# EAGLE schematic tes1 (EAGLE 6.6.0)
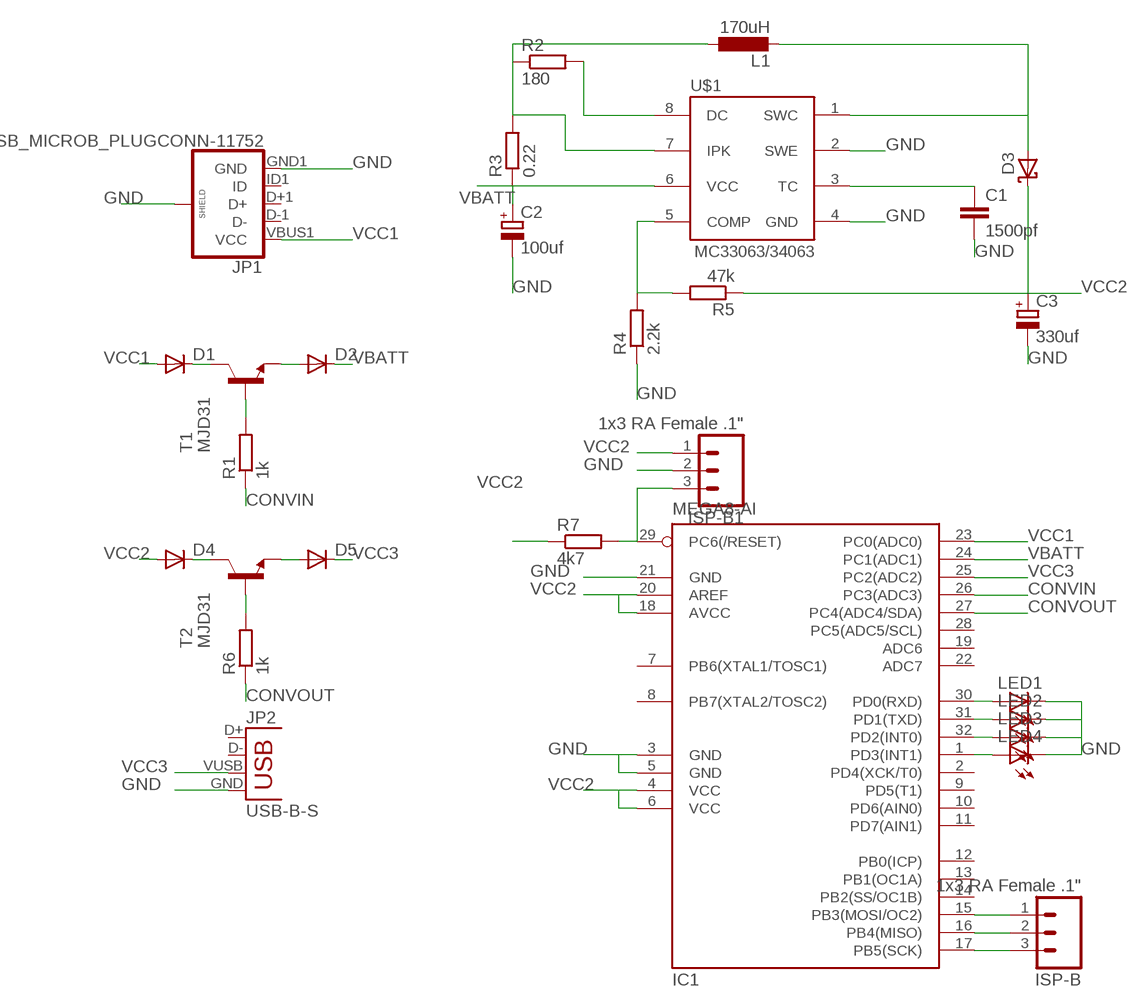
[diagram p0: schematic, sheet 1]

## Parts
C1  1500pf  C-EUC1206  [C1206]
C2  100uf  CPOL-EU153CLV-1014  [153CLV-1014]
C3  330uf  CPOL-EU153CLV-1014  [153CLV-1014]
D1  DIODE-SMC  [SMC]
D2  DIODE-SMC  [SMC]
D3  SCHOTTKY-DIODEF126Z12  [F126Z12]
D4  DIODE-SMC  [SMC]
D5  DIODE-SMC  [SMC]
IC1  MEGA8-AI  [TQFP32-08]
ISP-B  1x3 RA Female .1"  M03SMD_RA_FEMALE  [1X03_SMD_RA_FEMALE]
ISP-B1  1x3 RA Female .1"  M03SMD_RA_FEMALE  [1X03_SMD_RA_FEMALE]
JP1  USB_MICROB_PLUGCONN-11752  [USB-B-MICRO-SMD_V03]
JP2  USB-B-S  [USB-B-SMT]
L1  170uH  L-EUL5650M  [L5650M]
LED1  LEDSML1206  [SML1206]
LED2  LEDSML1206  [SML1206]
LED3  LEDSML1206  [SML1206]
LED4  LEDSML1206  [SML1206]
R1  1k  R-EU_R1206  [R1206]
R2  180  R-EU_R1206  [R1206]
R3  0.22  R-EU_R1206  [R1206]
R4  2.2k  R-EU_R1206  [R1206]
R5  47k  R-EU_R1206  [R1206]
R6  1k  R-EU_R1206  [R1206]
R7  4k7  R-EU_R1206  [R1206]
T1  MJD31  [DPAK]
T2  MJD31  [DPAK]
U$1  MC33063/MC34063D  [SO08]

## Nets
CONVIN: IC1.26(PC3(ADC3)) R1.1
CONVOUT: IC1.27(PC4(ADC4/SDA)) R6.1
GND: C1.2 C2.- C3.- IC1.3(GND) IC1.5(GND) IC1.21(GND) ISP-B1.2 JP1.GND1(GND) JP1.SHIELD1(SHIELD) JP1.SHIELD2(SHIELD) JP1.SHIELD3(SHIELD) JP2.GND LED1.C LED2.C LED3.C LED4.C R4.1 U$1.2(SWE) U$1.4(GND)
N$1: D1.C T1.4(C)
N$2: C1.1 U$1.3(TC)
N$3: D2.A T1.3(E)
N$4: L1.1 R2.1 R3.2 U$1.7(IPK)
N$5: R1.2 T1.1(B)
N$6: R2.2 U$1.8(DC)
N$7: R4.2 R5.2 U$1.5(COMP)
N$8: D4.C T2.4(C)
N$9: D3.A L1.2 U$1.1(SWC)
N$10: D5.A T2.3(E)
N$11: R6.2 T2.1(B)
N$12: IC1.29(PC6(/RESET)) ISP-B1.3 R7.2
N$13: IC1.17(PB5(SCK)) ISP-B.3
N$14: IC1.16(PB4(MISO)) ISP-B.2
N$15: IC1.15(PB3(MOSI/OC2)) ISP-B.1
N$16: IC1.1(PD3(INT1)) LED4.A
N$17: IC1.32(PD2(INT0)) LED3.A
N$18: IC1.31(PD1(TXD)) LED2.A
N$19: IC1.30(PD0(RXD)) LED1.A
VBATT: C2.+ D2.C IC1.24(PC1(ADC1)) R3.1 U$1.6(VCC)
VCC1: D1.A IC1.23(PC0(ADC0)) JP1.VBUS1(VCC)
VCC2: C3.+ D3.C D4.A IC1.4(VCC) IC1.6(VCC) IC1.18(AVCC) IC1.20(AREF) ISP-B1.1 R5.1 R7.1
VCC3: D5.C IC1.25(PC2(ADC2)) JP2.VUSB(VBUS)
Unconnected: IC1.2(PD4(XCK/T0)) IC1.7(PB6(XTAL1/TOSC1)) IC1.8(PB7(XTAL2/TOSC2)) IC1.9(PD5(T1)) IC1.10(PD6(AIN0)) IC1.11(PD7(AIN1)) IC1.12(PB0(ICP)) IC1.13(PB1(OC1A)) IC1.14(PB2(SS/OC1B)) IC1.19(ADC6) IC1.22(ADC7) IC1.28(PC5(ADC5/SCL)) JP1.D+1(D+) JP1.D-1(D-) JP1.ID1(ID) JP2.D+ JP2.D-

## Library data of the parts
C1 = resistor:C-EU: CAPACITOR, European symbol
C2 C3 = resistor:CPOL-EU: POLARIZED CAPACITOR, European symbol
D1 D2 D4 D5 = diode:DIODE-: DIODE
D3 = adafruit:SCHOTTKY-DIODE: Schottky Diode
IC1 = atmel:MEGA8: MICROCONTROLLER 8 Kbytes FLASH, 1 kbytes SRAM, 512 bytes EEPROM, USART, 6-channel 10 bit ADC, 2-channel 8 bit ADC Pin compatible with Atmega48, ATMega88, ATMega168 Source: avr.lbr; MPN: ATMEGA8-16AU; OC_FARNELL: 9171371; OC_NEWARK: 73M8863
ISP-B ISP-B1 = SparkFun-Connectors:M03: Header 3 Standard 3-pin 0.1" header. Use with straight break away headers (SKU : PRT-00116), right angle break away headers (PRT-00553), swiss pins (PRT-00743), machine pins (PRT-00117), and female headers (PRT-00115). Molex polarized connector foot print use with SKU : PRT-08232 with associated crimp pins and housings.; PROD_ID: CONN-10926
JP1 = SparkFun-Connectors:USB_MICROB_PLUG: USB Micro-B connectors Some male, some female. Watch your step!; PROD_ID: CONN-11752
JP2 = SparkFun-Connectors:USB: USB Connectors USB-B-PTH is fully proven SKU : PRT-00139/CONN-08278 USB-miniB is fully proven SKU : PRT-00587 USB-A-PCB is untested. USB-A-H is throughly reviewed, but untested. Spark Fun Electronics SKU : PRT-00437 USB-B-SMT is throughly reviewed, but untested. Needs silkscreen touching up. USB-A-S has not been used/tested USB-MB-H has not been used/tested USB-MICROB has been used. CONN-09505
L1 = rcl:L-EU: INDUCTOR, European symbol
LED1-LED4 = led:LED: LED OSRAM: - CHIPLED LG R971, LG N971, LY N971, LG Q971, LY Q971, LO R971, LY R971 LH N974, LH R974 LS Q976, LO Q976, LY Q976 LO Q996 - Hyper CHIPLED LW Q18S LB Q993, LB Q99A, LB R99A - SideLED LS A670, LO A670, LY A670, LG A670, LP A670 LB A673, LV A673, LT A673, LW A673 LH A674 LY A675 LS A676, LA A676, LO A676, LY A676, LW A676 LS A679, LY A679, LG A679 - Hyper Micro SIDELED® LS Y876, LA Y876, LO Y876, LY Y876 LT Y87S - SmartLED LW L88C, LW L88S LB L89C, LB L89S, LG L890 LS L89K, LO L89K, LY L89K LS L896, LA L896, LO L896, LY L896 - TOPLED LS T670, LO T670, LY T670, LG T670, LP T670 LSG T670, LSP T670, LSY T670, LOP T670, LYG T670 LG T671, LOG T671, LSG T671 LB T673, LV T673, LT T673, LW T673 LH T674 LS T676, LA T676, LO T676, LY T676, LB T676, LH T676, LSB T676, LW T676 LB T67C, LV T67C, LT T67C, LS T67K, LO T67K, LY T67K, LW E67C LS E67B, LA E67B, LO E67B, LY E67B, LB E67C, LV E67C, LT E67C LW T67C LS T679, LY T679, LG T679 LS T770, LO T770, LY T770, LG T770, LP T770 LB T773, LV T773, LT T773, LW T773 LH T774 LS E675, LA E675, LY E675, LS T675 LS T776, LA T776, LO T776, LY T776, LB T776 LHGB T686 LT T68C, LB T68C - Hyper Mini TOPLED® LB M676 - Mini TOPLED Santana® LG M470 LS M47K, LO M47K, LY M47K Source: http://www.osram.convergy.de LUXEON: - LUMILED® LXK2-PW12-R00, LXK2-PW12-S00, LXK2-PW14-U00, LXK2-PW14-V00 LXK2-PM12-R00, LXK2-PM12-S00, LXK2-PM14-U00 LXK2-PE12-Q00, LXK2-PE12-R00, LXK2-PE12-S00, LXK2-PE14-T00, LXK2-PE14-U00 LXK2-PB12-K00, LXK2-PB12-L00, LXK2-PB12-M00, LXK2-PB14-N00, LXK2-PB14-P00, LXK2-PB14-Q00 LXK2-PR12-L00, LXK2-PR12-M00, LXK2-PR14-Q00, LXK2-PR14-R00 LXK2-PD12-Q00, LXK2-PD12-R00, LXK2-PD12-S00 LXK2-PH12-R00, LXK2-PH12-S00 LXK2-PL12-P00, LXK2-PL12-Q00, LXK2-PL12-R00 Source: www.luxeon.com KINGBRIGHT: KA-3528ASYC Source: www.kingbright.com
R1 R6 R7 = rcl:R-EU_: RESISTOR, European symbol
R2-R5 = resistor:R-EU_: RESISTOR, European symbol
T1 T2 = transistor-neu-to92:MJD31*: Complementary Power Transistors
U$1 = adafruit:MC33063/MC34063: MC33063 and MC34063 Basic DC/DC converter with internal power-NPN transistor, 100KHz, 1.5A peak switch current. 3-40 input/output.